# Altium schematic sheet CO2Sensor.SchDoc: CO2 Sensor
size A; DrawnBy: Sindre Hovland; Organization: Open sauce; Revision: V0; SheetNumber: 2; SheetTotal: 5
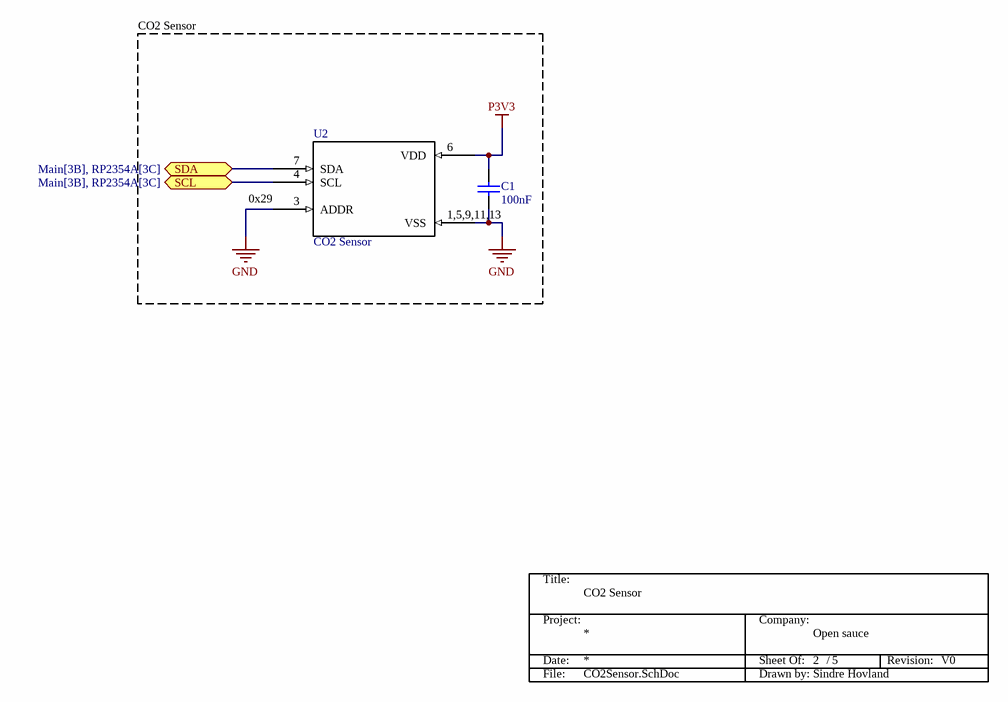
[diagram p0: CO2Sensor.SchDoc]

## Parts
*?  TitleBlock  (value not drawn)  (graphical)
C1  100nF  [C0201]
U2  CO2 Sensor  [STC31-C]

## Ports
SCL (bidir, see Main[3B], RP2354A[3C]), SDA (bidir, see Main[3B], RP2354A[3C])

## Nets
GND: C1.1 U2.1,5,9,11,13(VSS) U2.3(ADDR)
P3V3: C1.2 U2.6(VDD)
SCL: U2.4(SCL) ; port SCL
SDA: U2.7(SDA) ; port SDA

## Notes on the sheet
- CO2 Sensor
- (near U2) 0x29
- (in symbol TitleBlock) Title:; Project:; Company:; Date:; Sheet Of:; /; Revision:; File:; Drawn by:

## Library data of the parts
C1 = CAP: Capacitor; Value: 100pF; Published: 8-Jun-2000; Revision: July-2002: Re-released for DXP Platform.; Publisher: Altium Limited
U2 = STC31-C: CO₂ accuracy of ±(0.2 - 2.0 vol%) @0-100 vol%